# EasyEDA schematic SCH-typeC.json
TITLE: Sheet_1; REV: 1.0; Date: 2024-04-15; Sheet: 1/1; Drawn By: josephddang00too; Company: Your Company
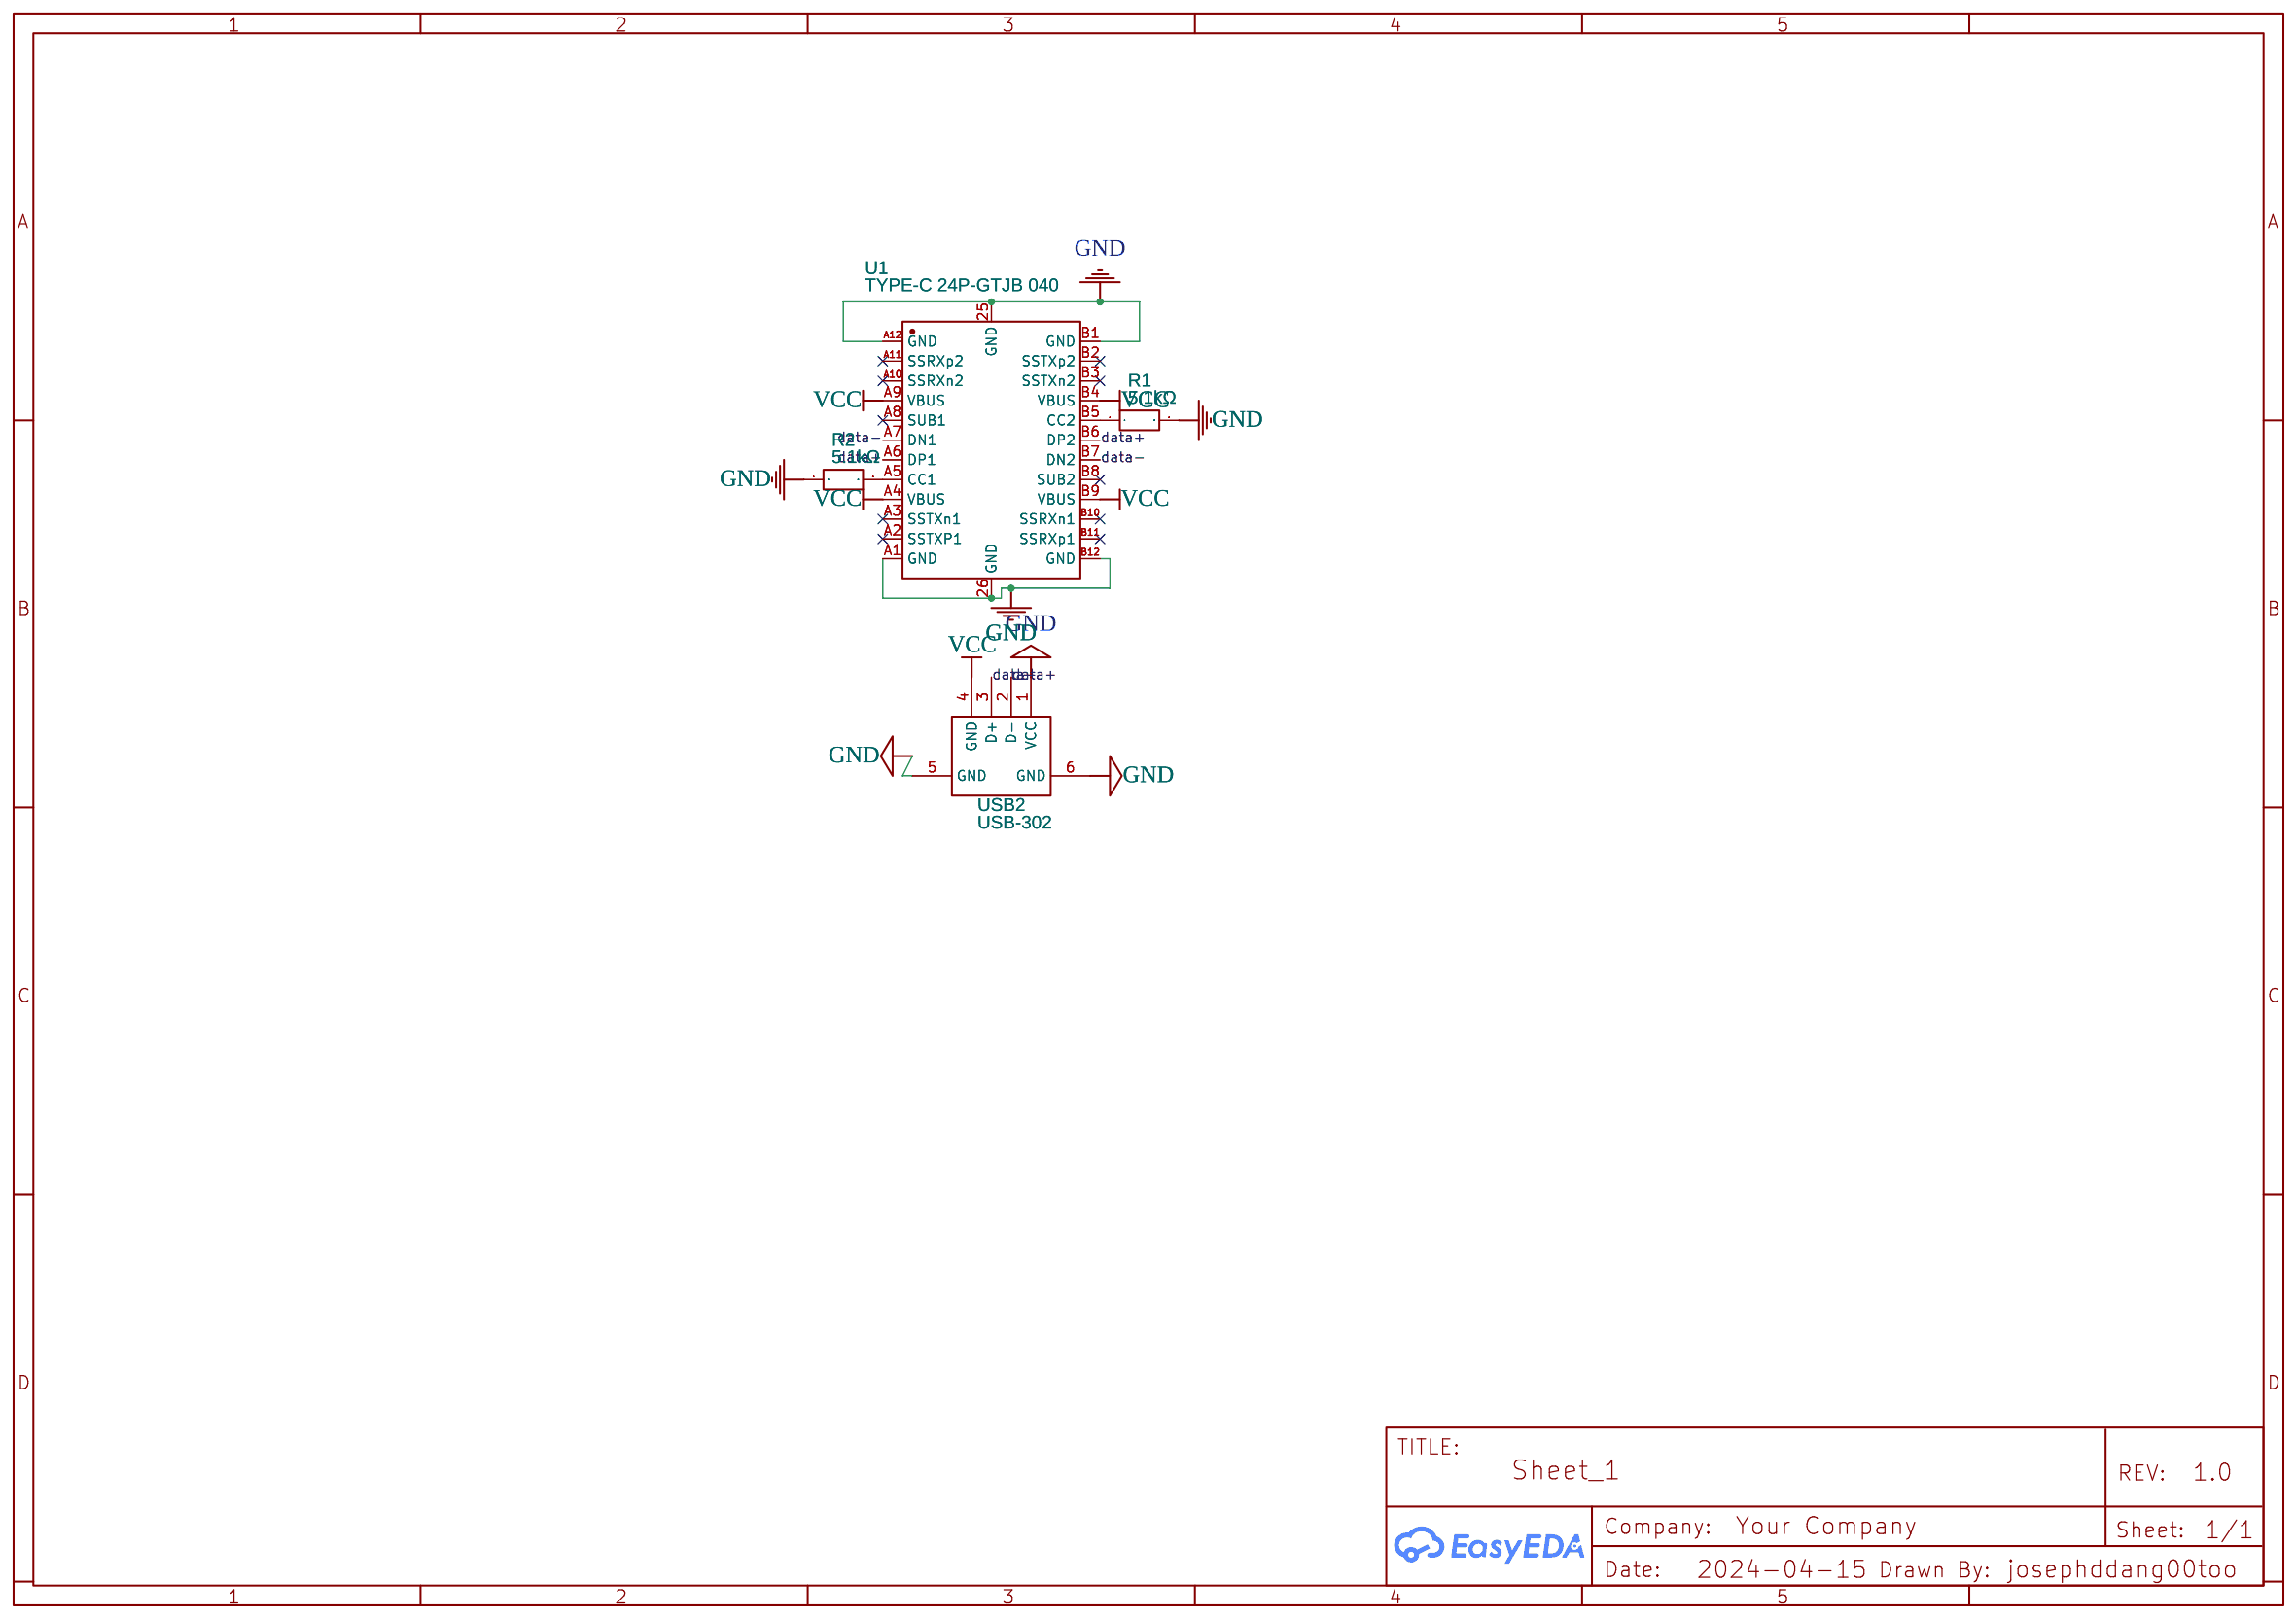
[diagram p0: schematic sheet]

## Parts
R1  5.1kΩ  [R0805]
R2  5.1kΩ  [R0805]
U1  TYPE-C 24P-GTJB 040  [USB-C-SMD_TYPE-C-24P-GTJB-040]
USB2  USB-302  [USB-A-TH_USB-302-T]

## Library data of the parts
R1 R2 = NQ05W8F5101T5E: Contributor: LCSC; Supplier: LCSC; Supplier Part: C965108; Manufacturer: UNI-ROYAL(厚声); JLCPCB Part Class: Extended Part
U1 = TYPE-C 24P-GTJB 040: Supplier: LCSC; Supplier Part: C3151751; Manufacturer: SHOU HAN(首韩); JLCPCB Part Class: Extended Part; Contributor: lcsc
USB2 = USB-302: Supplier: LCSC; Manufacturer: SOFNG(硕方); Manufacturer Part: USB-302-T; Supplier Part: C112456; JLCPCB Part Class: Extended Part

## Nets
GND: R1.2 R2.1 U1.25(GND) U1.26(GND) U1.A1(GND) U1.A12(GND) U1.B1(GND) U1.B12(GND) USB2.1(VCC) USB2.5(GND) USB2.6(GND)
VCC: U1.A4(VBUS) U1.A9(VBUS) U1.B4(VBUS) U1.B9(VBUS) USB2.4(GND)
data+: U1.A6(DP1) U1.B6(DP2) USB2.2(D-)
data-: U1.A7(DN1) U1.B7(DN2) USB2.3(D+)
Net-(R1-1): R1.1 U1.B5(CC2)
Net-(R2-2): R2.2 U1.A5(CC1)

Not connected (* = marked no-connect by the designer): U1 A2(SSTXP1)* A3(SSTXn1)* A8(SUB1)* A10(SSRXn2)* A11(SSRXp2)* B2(SSTXp2)* B3(SSTXn2)* B8(SUB2)* B10(SSRXn1)* B11(SSRXp1)*
